# Altium schematic sheet Sheet2.SchDoc
size A4
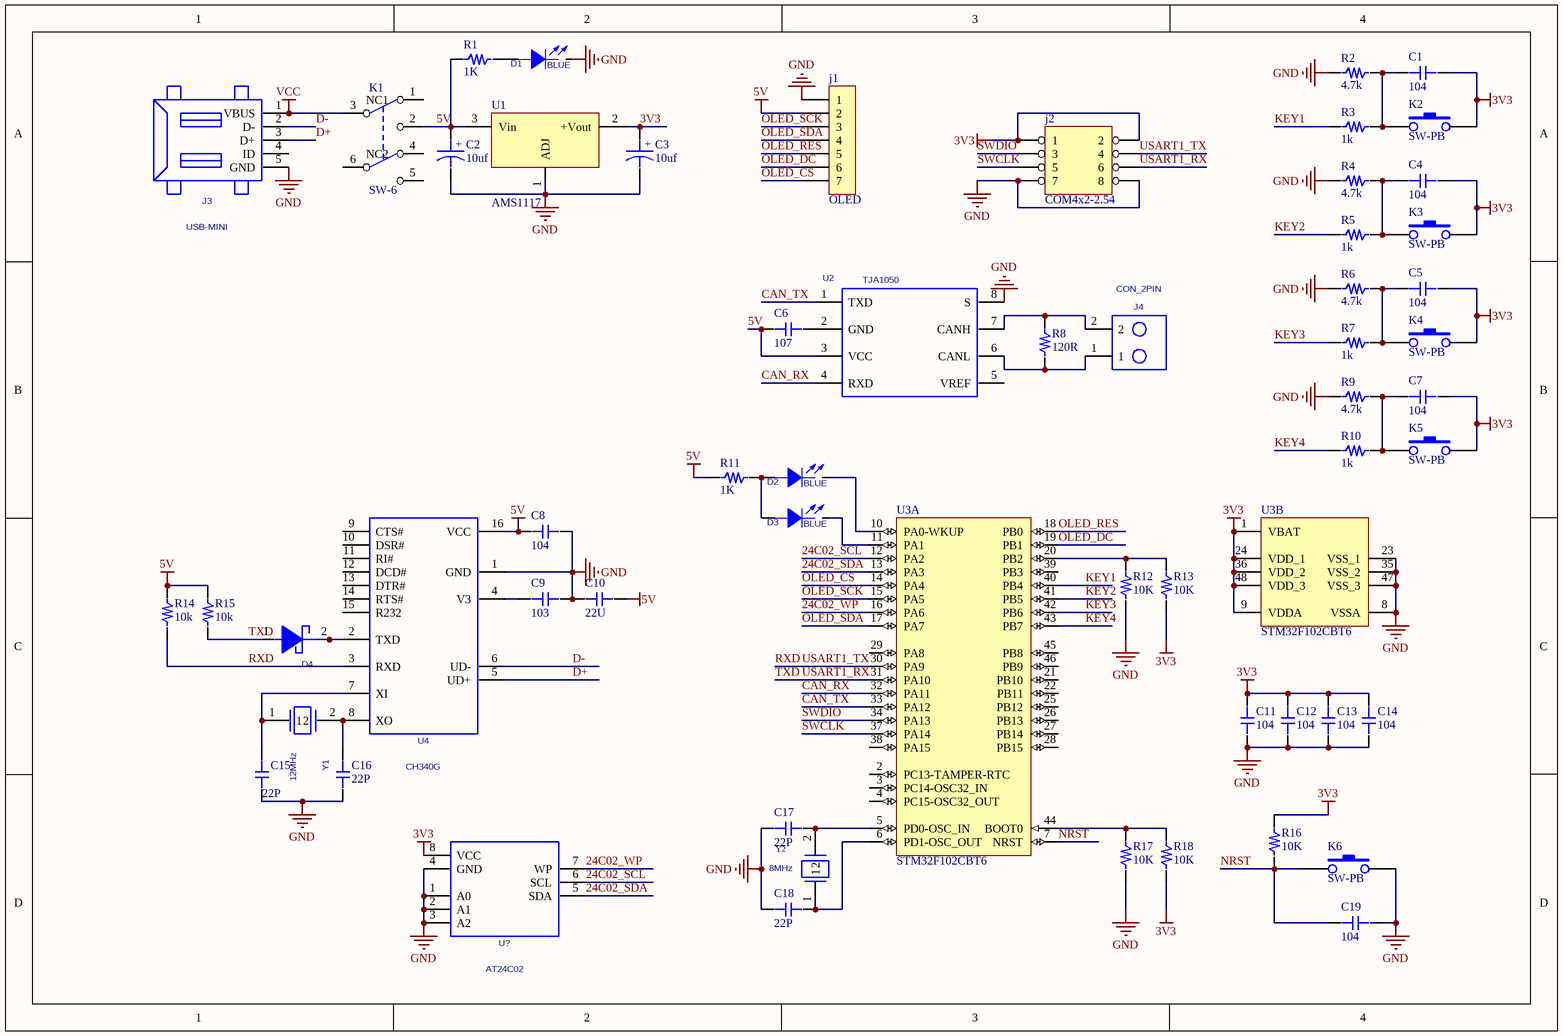
[diagram p0: Sheet2.SchDoc]

## Parts
C1  104  [C_0603]
C2  10uf  [SMD-EC-F3]
C3  10uf  [SMD-EC-F3]
C4  104  [C_0603]
C5  104  [C_0603]
C6  107  [C_0603]
C7  104  [C_0603]
C8  104  [C_0603]
C9  103  [C_0603]
C10  22U  [C_0603]
C11  104  [C_0603]
C12  104  [C_0603]
C13  104  [C_0603]
C14  104  [C_0603]
C15  22P  [C_0603]
C16  22P  [C_0603]
C17  22P  [C_0603]
C18  22P  [C_0603]
C19  104  [C_0603]
D1  value BLUE  [LED_0603]  (hidden comment: LED)
D2  value BLUE  [LED_0603]  (hidden comment: LED)
D3  value BLUE  [LED_0603]  (hidden comment: LED)
D4  SMAJ5.0CA  [DO-214-A]  (value not drawn)
j1  OLED  [OLED_7]
j2  COM4x2-2.54  [COM4X2-2.54]
J3  USB-MINI  [USB-MINI]
J4  CON_2PIN  [CON_2PIN]
K1  SW-6  [SW-6]
K2  SW-PB  [SW6.2/6.2-SMD]
K3  SW-PB  [SW6.2/6.2-SMD]
K4  SW-PB  [SW6.2/6.2-SMD]
K5  SW-PB  [SW6.2/6.2-SMD]
K6  SW-PB  [SW-PB4]
R1  1K  [R_0603]
R2  4.7k  [R_0603]
R3  1k  [R_0603]
R4  4.7k  [R_0603]
R5  1k  [R_0603]
R6  4.7k  [R_0603]
R7  1k  [R_0603]
R8  120R  [R_0603]
R9  4.7k  [R_0603]
R10  1k  [R_0603]
R11  1K  [R_0603]
R12  10K  [R_0603]
R13  10K  [R_0603]
R14  10k  [R_0603]
R15  10k  [R_0603]
R16  10K  [R_0603]
R17  10K  [R_0603]
R18  10K  [R_0603]
U1  AMS1117  [SOT-223]
U2  TJA1050  [SOP8]
U3  STM32F102CBT6  [STM-LQFP48_N]  (parts A,B of 2)
U4  CH340G  [SOP16]
U?  AT24C02  [SOP8]
Y1  value 12MHz  [CRYS-3X8]  (hidden comment: XTAL_32.768KHZ)
Y2  value 8MHz  [XTAL_SMD]  (hidden comment: XTAL_49US)

## Nets
3V3: C1.2 C3.1(+) C4.2 C5.2 C7.2 C11.2 C12.2 C13.2 C14.2 j2.1 j2.2 K2.2 K3.2 K4.2 K5.2 R13.2 R16.2 R18.2 U1.2(+Vout) U3.1(VBAT) U3.9(VDDA) U3.24(VDD_1) U3.36(VDD_2) U3.48(VDD_3) U?.8(VCC)
5V: C2.1(+) C6.1 C8.2 C10.1 j1.2 K1.2(NO1) R1.1 R11.2 R14.1 R15.1 U1.3(Vin) U2.3(VCC) U4.16(VCC)
GND: C2.2(-) C3.2(-) C8.1 C9.1 C10.2 C11.1 C12.1 C13.1 C14.1 C15.1 C16.1 C17.1 C18.1 C19.2 D1.2(CATHODE) j1.1 j2.7 j2.8 J3.5(GND) K6.2 R2.1 R4.1 R6.1 R9.1 R12.1 R17.1 U1.1(ADJ) U2.8(S) U3.8(VSSA) U3.23(VSS_1) U3.35(VSS_2) U3.47(VSS_3) U4.1(GND) U?.1(A0) U?.2(A1) U?.3(A2) U?.4(GND)
VCC: J3.1(VBUS) K1.3(COMMON1)
24C02_SCL: U3.12(PA2) U?.6(SCL)
24C02_SDA: U3.13(PA3) U?.5(SDA)
24C02_WP: U3.16(PA6) U?.7(WP)
CAN_RX: U2.4(RXD) U3.32(PA11)
CAN_TX: U2.1(TXD) U3.33(PA12)
D+: J3.3(D+) U4.5(UD+)
D-: J3.2(D-) U4.6(UD-)
KEY1: R3.1 U3.40(PB4)
KEY2: R5.1 U3.41(PB5)
KEY3: R7.1 U3.42(PB6)
KEY4: R10.1 U3.43(PB7)
NRST: C19.1 K6.1 R16.1 U3.7(NRST)
OLED_CS: j1.7 U3.14(PA4)
OLED_DC: j1.6 U3.19(PB1)
OLED_RES: j1.5 U3.18(PB0)
OLED_SCK: j1.3 U3.15(PA5)
OLED_SDA: j1.4 U3.17(PA7)
RXD: j2.4 R14.2 U3.30(PA9) U4.3(RXD)  [also labelled USART1_TX]
SWCLK: j2.5 U3.37(PA14)
SWDIO: j2.3 U3.34(PA13)
TXD: D4.1(+) j2.6 R15.2 U3.31(PA10)  [also labelled USART1_RX]
NetC1_1: C1.1 K2.1 R2.2 R3.2
NetC4_1: C4.1 K3.1 R4.2 R5.2
NetC5_1: C5.1 K4.1 R6.2 R7.2
NetC6_2: C6.2 U2.2(GND)
NetC7_1: C7.1 K5.1 R9.2 R10.2
NetC9_2: C9.2 U4.4(V3)
NetC15_2: C15.2 U4.7(XI) Y1.1
NetC16_2: C16.2 U4.8(XO) Y1.2
NetC17_2: C17.2 U3.5(PD0-OSC_IN) Y2.2
NetC18_2: C18.2 U3.6(PD1-OSC_OUT) Y2.1
NetD1_1: D1.1(ANODE) R1.2
NetD2_1: D2.1(ANODE) D3.1(ANODE) R11.1
NetD2_2: D2.2(CATHODE) U3.10(PA0-WKUP)
NetD3_2: D3.2(CATHODE) U3.11(PA1)
NetD4_2: D4.2(-) U4.2(TXD)
NetJ4_1: J4.1 R8.1 U2.6(CANL)
NetJ4_2: J4.2 R8.2 U2.7(CANH)
NetR12_2: R12.2 R13.1 U3.20(PB2)
NetR17_2: R17.2 R18.1 U3.44(BOOT0)

Not connected (* = marked no-connect by the designer): J3 4(ID); K1 1(NC1) 4(NC2) 5(NO2) 6(COMMON2); U2 5(VREF); U3 2(PC13-TAMPER-RTC) 3(PC14-OSC32_IN) 4(PC15-OSC32_OUT) 21(PB10) 22(PB11) 25(PB12) 26(PB13) 27(PB14) 28(PB15) 29(PA8) 38(PA15) 39(PB3) 45(PB8) 46(PB9); U4 9(CTS#) 10(DSR#) 11(RI#) 12(DCD#) 13(DTR#) 14(RTS#) 15(R232)

## Library data of the parts
C1 C4-C19 = CAP
C2 C3 = CAP+
D4 = SMAJ5.0CA: SMAJ5.0CA-E3/61 400W 5V; PCB DECAL: DO-214; Manufacture 1 P/N: SMAJ5.0CA; Value: SMAJ5.0CA
j1 = COM7-2.54
R1-R18 = RES
U3 = STM32F102CBT6: ARM Cortex-M3 32-bit MCU, 128 KB Flash, 16 KB Internal RAM, 37 I/Os, 48-pin LQFP, -40 to 85 degC, Tray; A/D Converter: 1x12-bit (10 Channel); FLASH Size (Prog) (kB): 128; I/Os (High Current): 37; Internal RAM Size (kB): 16; Operating Frequency(F) (Processor speed) (MHz): 48; Supply Voltage(Vcc) min (V): 2; DatasheetVersion: Rev. 5; PackageVersion: Rev. 6, 06/2013; PackageReference: LQFP48; PackageDescription: 48-Pin Low Profile Quad Flat Package, 7 x 7 mm Body, 0.5 mm Pitch; Supplier 1: Digi-Key; Supplier Part Number 1: 497-8308-ND; Supplier 2: Farnell; Supplier Part Number 2: 2333154; Supplier 3: Newark; Supplier Part Number 3: 99W9776; Supplier 4: Newark; Supplier Part Number 4: 25R9430; Supplier 5: Mouser; Supplier Part Number 5: 511-STM32F102CBT6; Core: ARM Cortex-M3; Packing: Tray; Mounting Technology: Surface Mount; PartNumber: STM32F102CBT6; ComponentLink1Description: Manufacturer URL; ComponentLink1URL: http://www.st.com/web/en/home.html; ComponentLink2Description: Datasheet; ComponentLink2URL: http://www.st.com/st-web-ui/static/active/en/resource/technical/document/datasheet/CD00210831.pdf; ComponentLink3Description: Package Specification; ComponentLink3URL: http://www.st.com/st-web-ui/static/active/en/resource/technical/document/datasheet/DM00058181.pdf
D1-D3 = LED: PCB DECAL: LED_0603
J3 = USB-MINI: PCB DECAL: USB-MINI
J4 = CON_2PIN: PCB DECAL: CON_2PIN
U2 = TJA1050: PCB DECAL: SOP8
U4 = CH340G: PCB DECAL: SOP16
U? = AT24C02: PCB DECAL: SOP8
Y1 = XTAL_32.768KHZ: PCB DECAL: CRYS-3X8
Y2 = XTAL_49US: PCB DECAL: XTAL_SMD